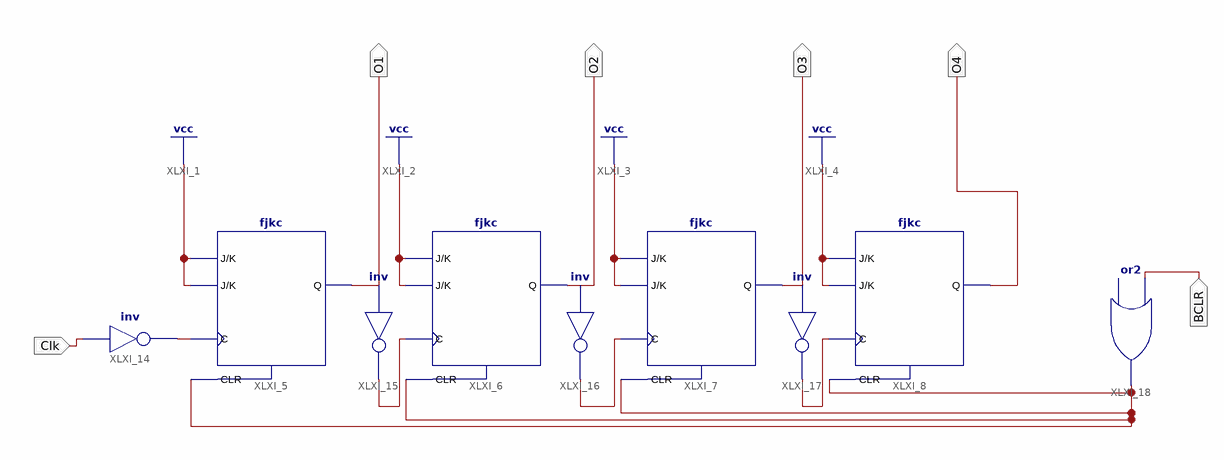
[diagram p0: schematic sheet 1]
// Xilinx ISE schematic nCounter0_9.sch (spartan6) as structural Verilog: 9 symbols, 6 ports
module nCounter0_9 (
  input  Clk,
  input  BCLR,
  output O4,
  output O2,
  output O3,
  output O1
);

  wire XLXN_11, XLXN_12, XLXN_13, XLXN_15, XLXN_16;

  fjkc XLXI_5 (.C(XLXN_11), .CLR(XLXN_16), .J(1'b1), .K(1'b1), .Q(O1));
  fjkc XLXI_6 (.C(XLXN_15), .CLR(XLXN_16), .J(1'b1), .K(1'b1), .Q(O2));
  fjkc XLXI_7 (.C(XLXN_12), .CLR(XLXN_16), .J(1'b1), .K(1'b1), .Q(O3));
  fjkc XLXI_8 (.C(XLXN_13), .CLR(XLXN_16), .J(1'b1), .K(1'b1), .Q(O4));
  not XLXI_14 (XLXN_11, Clk);
  not XLXI_16 (XLXN_12, O2);
  not XLXI_17 (XLXN_13, O3);
  not XLXI_15 (XLXN_15, O1);
  buf XLXI_18 (XLXN_16, BCLR);  // or2 open: I0
endmodule
